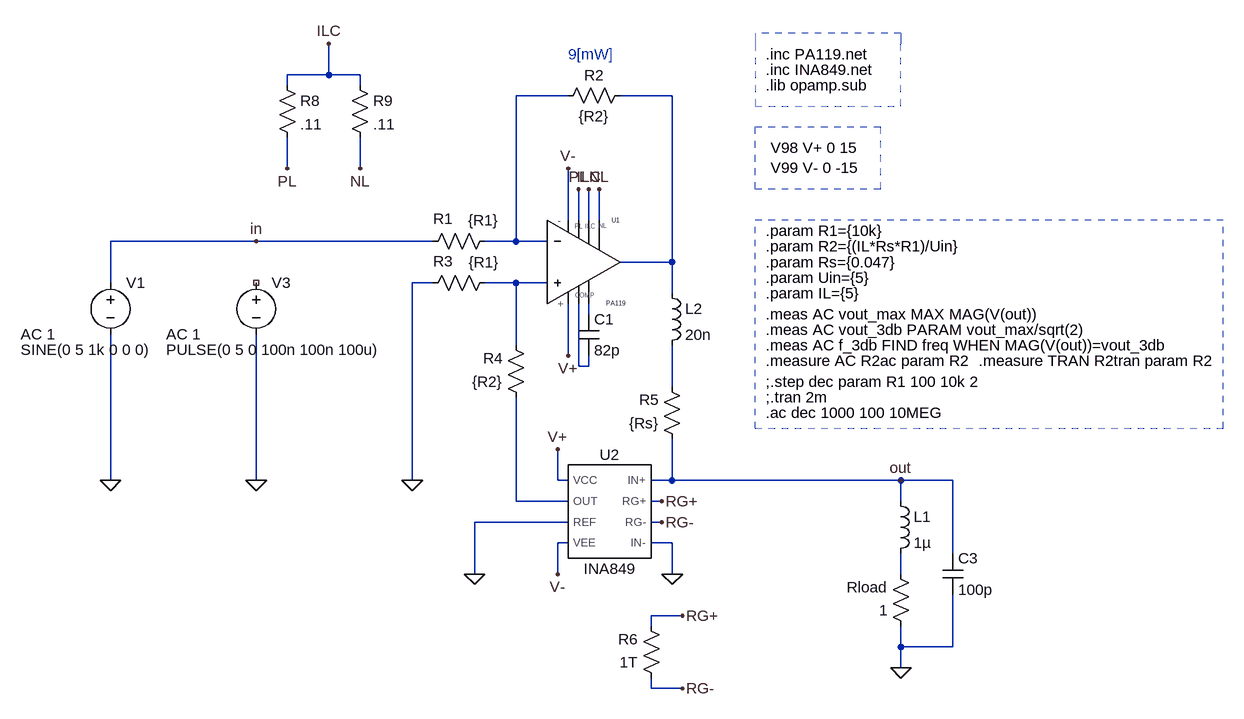
[diagram p0: schematic Howland_current_2.asc]
Howland_current_2.asc, the LTspice schematic file:
Version 4
SHEET 1 1784 11864
WIRE -976 304 -976 256
WIRE -976 304 -1040 304
WIRE -928 304 -976 304
WIRE -1040 320 -1040 304
WIRE -928 320 -928 304
WIRE -608 336 -688 336
WIRE -448 336 -528 336
WIRE -1040 448 -1040 400
WIRE -928 448 -928 400
WIRE -608 528 -608 448
WIRE -592 528 -592 480
WIRE -576 528 -576 480
WIRE -560 528 -560 480
WIRE -1088 560 -1312 560
WIRE -816 560 -1088 560
WIRE -688 560 -688 336
WIRE -688 560 -736 560
WIRE -640 560 -688 560
WIRE -448 592 -448 336
WIRE -448 592 -528 592
WIRE -1312 624 -1312 560
WIRE -816 624 -848 624
WIRE -688 624 -736 624
WIRE -640 624 -688 624
WIRE -448 640 -448 592
WIRE -576 672 -576 656
WIRE -688 720 -688 624
WIRE -608 736 -608 656
WIRE -592 752 -592 656
WIRE -576 752 -576 736
WIRE -576 752 -592 752
WIRE -448 784 -448 720
WIRE -1312 928 -1312 704
WIRE -1088 928 -1088 704
WIRE -848 928 -848 624
WIRE -624 928 -624 880
WIRE -608 928 -624 928
WIRE -448 928 -448 864
WIRE -448 928 -480 928
WIRE -96 928 -448 928
WIRE -16 928 -96 928
WIRE -688 960 -688 800
WIRE -608 960 -688 960
WIRE -464 960 -480 960
WIRE -96 960 -96 928
WIRE -608 992 -752 992
WIRE -464 992 -480 992
WIRE -608 1024 -624 1024
WIRE -448 1024 -480 1024
WIRE -16 1040 -16 928
WIRE -752 1072 -752 992
WIRE -624 1072 -624 1024
WIRE -448 1072 -448 1024
WIRE -96 1072 -96 1040
WIRE -432 1136 -480 1136
WIRE -480 1152 -480 1136
WIRE -96 1184 -96 1152
WIRE -16 1184 -16 1104
WIRE -16 1184 -96 1184
WIRE -96 1216 -96 1184
WIRE -480 1248 -480 1232
WIRE -432 1248 -480 1248
FLAG -608 736 V+
FLAG -608 448 V-
FLAG -848 928 0
FLAG -1088 928 0
FLAG -592 480 PL
FLAG -576 480 ILC
FLAG -560 480 NL
FLAG -1040 448 PL
FLAG -976 256 ILC
FLAG -928 448 NL
FLAG -96 1216 0
FLAG -624 880 V+
FLAG -624 1072 V-
FLAG -752 1072 0
FLAG -432 1136 RG+
FLAG -432 1248 RG-
FLAG -464 960 RG+
FLAG -464 992 RG-
FLAG -448 1072 0
FLAG -1088 560 in
FLAG -96 928 out
FLAG -1312 928 0
SYMBOL res -720 544 R90
WINDOW 0 -3 80 VBottom 2
WINDOW 3 -32 18 VTop 2
SYMATTR InstName R1
SYMATTR Value {R1}
SYMBOL res -512 320 R90
WINDOW 0 0 56 VBottom 2
WINDOW 3 32 56 VTop 2
SYMATTR InstName R2
SYMATTR Value {R2}
SYMBOL res -720 608 R90
WINDOW 0 -2 80 VBottom 2
WINDOW 3 -31 17 VTop 2
SYMATTR InstName R3
SYMATTR Value {R1}
SYMBOL res -672 816 R180
WINDOW 0 36 76 Left 2
WINDOW 3 36 40 Left 2
SYMATTR InstName R4
SYMATTR Value {R2}
SYMBOL voltage -1088 608 R0
WINDOW 3 -138 119 Left 2
WINDOW 123 -138 95 Left 2
WINDOW 39 0 0 Left 0
SYMATTR Value PULSE(0 5 0 100n 100n 100u)
SYMATTR Value2 AC 1
SYMATTR InstName V3
SYMBOL cap -592 736 M180
WINDOW 0 24 56 Left 2
WINDOW 3 24 8 Left 2
SYMATTR InstName C1
SYMATTR Value 82p
SYMBOL res -1056 304 R0
SYMATTR InstName R8
SYMATTR Value .11
SYMBOL res -944 304 R0
SYMATTR InstName R9
SYMATTR Value .11
SYMBOL PA119 -560 608 M180
SYMATTR InstName U1
SYMBOL res -432 880 R180
WINDOW 0 36 76 Left 2
WINDOW 3 36 40 Left 2
SYMATTR InstName R5
SYMATTR Value {Rs}
SYMBOL res -80 1168 R180
WINDOW 0 36 76 Left 2
WINDOW 3 36 40 Left 2
SYMATTR InstName Rload
SYMATTR Value 1
SYMBOL INA849 -544 976 M0
SYMATTR InstName U2
SYMBOL res -464 1248 R180
WINDOW 0 36 76 Left 2
WINDOW 3 36 40 Left 2
SYMATTR InstName R6
SYMATTR Value 1T
SYMBOL ind -112 944 R0
SYMATTR InstName L1
SYMATTR Value 1µ
SYMBOL cap -32 1040 R0
SYMATTR InstName C3
SYMATTR Value 100p
SYMBOL ind -464 624 R0
SYMATTR InstName L2
SYMATTR Value 20n
SYMBOL voltage -1312 608 R0
WINDOW 3 -138 119 Left 2
WINDOW 123 -138 95 Left 2
WINDOW 39 0 0 Left 0
SYMATTR Value SINE(0 5 1k 0 0 0)
SYMATTR Value2 AC 1
SYMATTR InstName V1
TEXT -304 800 Left 2 !;.tran 2m
TEXT -304 544 Left 2 !.param R1={10k}
TEXT -304 568 Left 2 !.param R2={(IL*Rs*R1)/Uin}
TEXT -296 416 Left 2 !V98 V+ 0 15\nV99 V- 0 -15
TEXT -304 776 Left 2 !;.step dec param R1 100 10k 2
TEXT -304 320 Left 2 !.lib opamp.sub
TEXT -304 296 Left 2 !.inc INA849.net
TEXT -304 272 Left 2 !.inc PA119.net
TEXT -304 592 Left 2 !.param Rs={0.047}
TEXT -304 616 Left 2 !.param Uin={5}
TEXT -304 640 Left 2 !.param IL={5}
TEXT -304 672 Left 2 !.meas AC vout_max MAX MAG(V(out))
TEXT -304 696 Left 2 !.meas AC vout_3db PARAM vout_max/sqrt(2)
TEXT -304 720 Left 2 !.meas AC f_3db FIND freq WHEN MAG(V(out))=vout_3db
TEXT -304 824 Left 2 !.ac dec 1000 100 10MEG
TEXT -304 744 Left 2 !.measure AC R2ac param R2
TEXT 24 744 Left 2 !.measure TRAN R2tran param R2
TEXT -608 272 Left 2 ;9[mW]
LINE Normal -96 240 -320 240 3
LINE Normal -96 352 -96 256 3
LINE Normal -320 352 -96 352 3
LINE Normal -320 256 -320 352 3
LINE Normal -320 240 -320 256 3
LINE Normal -96 240 -96 256 3
LINE Normal -320 480 -320 384 3
LINE Normal -128 480 -320 480 3
LINE Normal -128 384 -128 480 3
LINE Normal -320 384 -128 384 3
LINE Normal 400 528 -320 528 4
LINE Normal -320 848 400 848 4
LINE Normal -320 848 -320 528 2
LINE Normal 400 848 400 528 2

The netlist it stands for:
* Howland_current_2.asc
R1 N001 in {R1}
R2 N002 N001 {R2}
R3 N003 0 {R1}
R4 N007 N003 {R2}
V3 NC_01 0 PULSE(0 5 0 100n 100n 100u) AC 1
C1 N005 N004 82p
R8 ILC PL .11
R9 ILC NL .11
XU1 N003 N001 N002 V+ V- N005 N004 PL ILC NL PA119  ; pins +IN -IN OUT +V -V COMP COMP PL ILC NL
R5 out N006 {Rs}
Rload 0 N008 1
XU2 out 0 V+ V- N007 0 RG+ RG- INA849  ; pins IN+ IN- VCC VEE OUT REF RG+ RG-
R6 RG- RG+ 1T
L1 out N008 1µ
C3 out 0 100p
L2 N002 N006 20n
V1 in 0 SINE(0 5 1k 0 0 0) AC 1
;.tran 2m
.param R1={10k}
.param R2={(IL*Rs*R1)/Uin}
V98 V+ 0 15
V99 V- 0 -15
;.step dec param R1 100 10k 2
.lib opamp.sub
.inc INA849.net
.inc PA119.net
.param Rs={0.047}
.param Uin={5}
.param IL={5}
.meas AC vout_max MAX MAG(V(out))
.meas AC vout_3db PARAM vout_max/sqrt(2)
.meas AC f_3db FIND freq WHEN MAG(V(out))=vout_3db
.ac dec 1000 100 10MEG
.measure AC R2ac param R2
.measure TRAN R2tran param R2
* 9[mW]
.lib .\INA849.net
.backanno
.end